# EAGLE design multi_board_support (EAGLE 6.5.0)

## Sheet 1 of 2
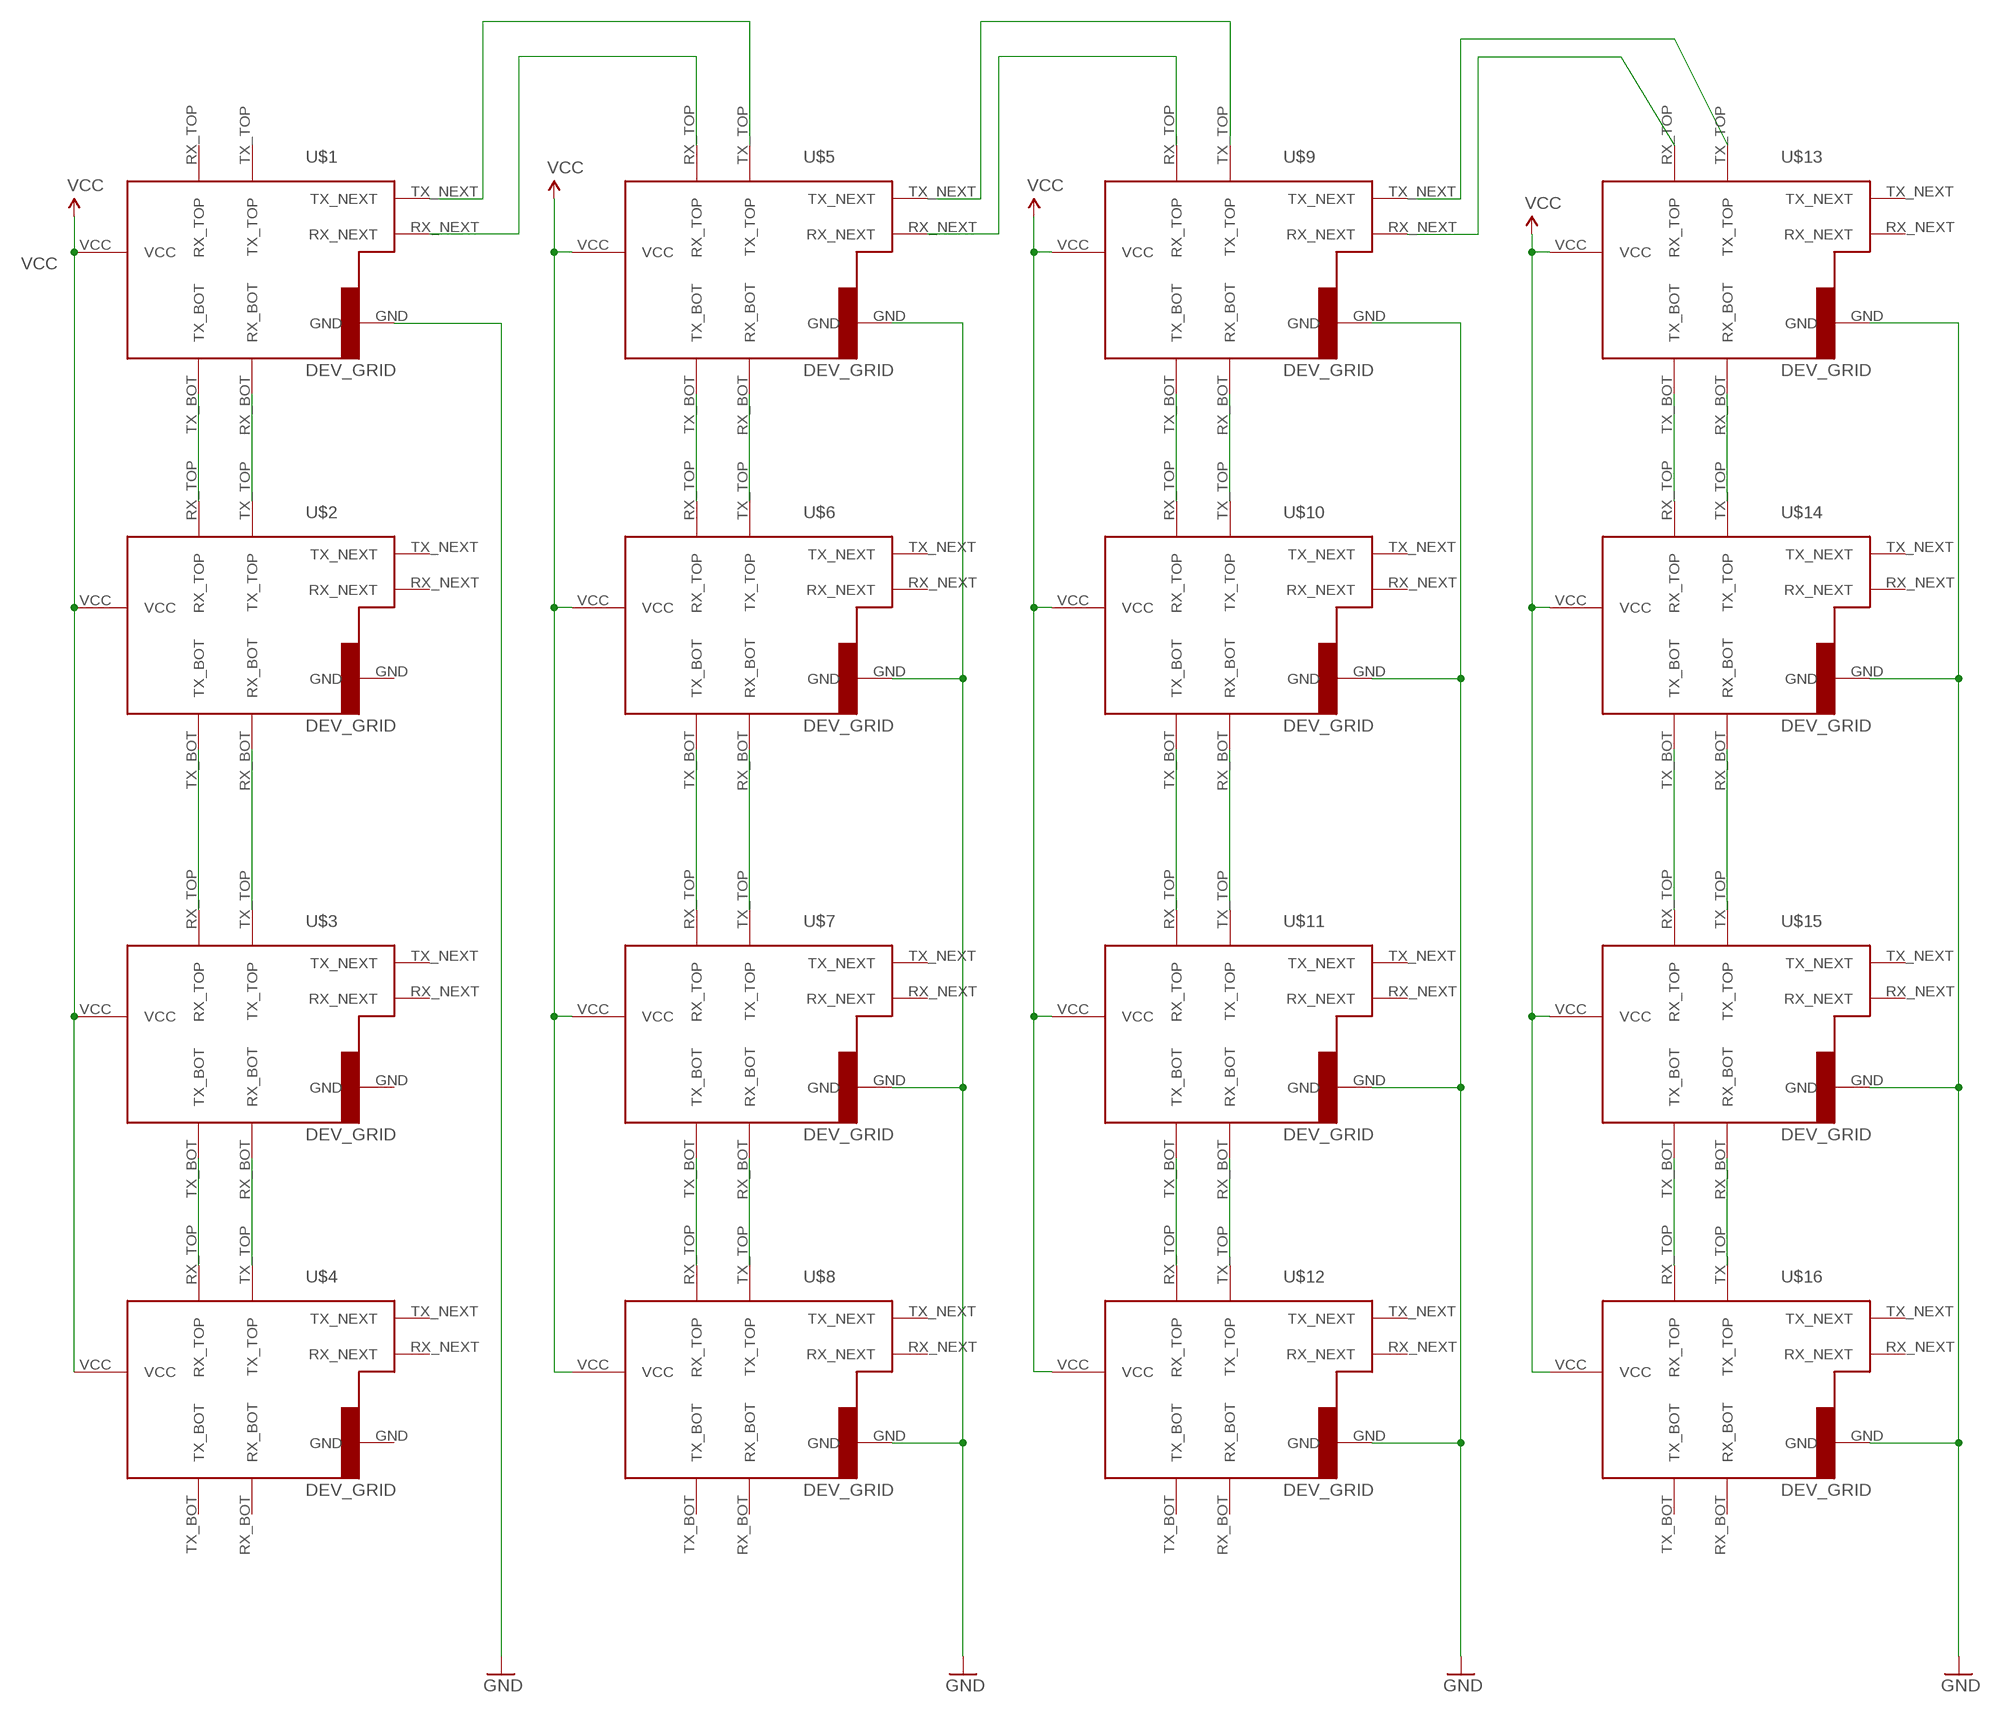
[diagram p0: schematic, sheet 1]

### Parts
U$1  DEV_GRID  [PCB_LAY]
U$2  DEV_GRID  [PCB_LAY]
U$3  DEV_GRID  [PCB_LAY]
U$4  DEV_GRID  [PCB_LAY]
U$5  DEV_GRID  [PCB_LAY]
U$6  DEV_GRID  [PCB_LAY]
U$7  DEV_GRID  [PCB_LAY]
U$8  DEV_GRID  [PCB_LAY]
U$9  DEV_GRID  [PCB_LAY]
U$10  DEV_GRID  [PCB_LAY]
U$11  DEV_GRID  [PCB_LAY]
U$12  DEV_GRID  [PCB_LAY]
U$13  DEV_GRID  [PCB_LAY]
U$14  DEV_GRID  [PCB_LAY]
U$15  DEV_GRID  [PCB_LAY]
U$16  DEV_GRID  [PCB_LAY]

### Nets
GND: U$1.GND U$5.GND U$6.GND U$7.GND U$8.GND U$9.GND U$10.GND U$11.GND U$12.GND U$13.GND U$14.GND U$15.GND U$16.GND
N$1: U$1.TX_BOT U$2.RX_TOP
N$2: U$1.RX_BOT U$2.TX_TOP
N$3: U$2.TX_BOT U$3.RX_TOP
N$4: U$2.RX_BOT U$3.TX_TOP
N$5: U$3.TX_BOT U$4.RX_TOP
N$6: U$3.RX_BOT U$4.TX_TOP
N$7: U$5.TX_BOT U$6.RX_TOP
N$8: U$5.RX_BOT U$6.TX_TOP
N$9: U$6.TX_BOT U$7.RX_TOP
N$10: U$6.RX_BOT U$7.TX_TOP
N$11: U$7.TX_BOT U$8.RX_TOP
N$12: U$7.RX_BOT U$8.TX_TOP
N$13: U$9.TX_BOT U$10.RX_TOP
N$14: U$9.RX_BOT U$10.TX_TOP
N$15: U$10.TX_BOT U$11.RX_TOP
N$16: U$10.RX_BOT U$11.TX_TOP
N$17: U$11.TX_BOT U$12.RX_TOP
N$18: U$11.RX_BOT U$12.TX_TOP
N$19: U$13.TX_BOT U$14.RX_TOP
N$20: U$13.RX_BOT U$14.TX_TOP
N$21: U$14.TX_BOT U$15.RX_TOP
N$22: U$14.RX_BOT U$15.TX_TOP
N$23: U$15.TX_BOT U$16.RX_TOP
N$24: U$15.RX_BOT U$16.TX_TOP
N$25: U$1.TX_NEXT U$5.TX_TOP
N$26: U$1.RX_NEXT U$5.RX_TOP
N$27: U$5.TX_NEXT U$9.TX_TOP
N$28: U$5.RX_NEXT U$9.RX_TOP
N$29: U$9.TX_NEXT U$13.TX_TOP
N$30: U$9.RX_NEXT U$13.RX_TOP
VCC: U$1.VCC U$2.VCC U$3.VCC U$4.VCC U$5.VCC U$6.VCC U$7.VCC U$8.VCC U$9.VCC U$10.VCC U$11.VCC U$12.VCC U$13.VCC U$14.VCC U$15.VCC U$16.VCC
Unconnected: U$1.RX_TOP U$1.TX_TOP U$2.RX_NEXT U$2.TX_NEXT U$3.RX_NEXT U$3.TX_NEXT U$4.RX_BOT U$4.RX_NEXT U$4.TX_BOT U$4.TX_NEXT U$6.RX_NEXT U$6.TX_NEXT U$7.RX_NEXT U$7.TX_NEXT U$8.RX_BOT U$8.RX_NEXT U$8.TX_BOT U$8.TX_NEXT U$10.RX_NEXT U$10.TX_NEXT U$11.RX_NEXT U$11.TX_NEXT U$12.RX_BOT U$12.RX_NEXT U$12.TX_BOT U$12.TX_NEXT U$13.RX_NEXT U$13.TX_NEXT U$14.RX_NEXT U$14.TX_NEXT U$15.RX_NEXT U$15.TX_NEXT U$16.RX_BOT U$16.RX_NEXT U$16.TX_BOT U$16.TX_NEXT

## Sheet 2 of 2

## Power pins joined to a net without a drawn wire
GND: U$2.GND U$3.GND U$4.GND

## Library data of the parts
U$1-U$16 = grid_component:DEV_GRID

## Board
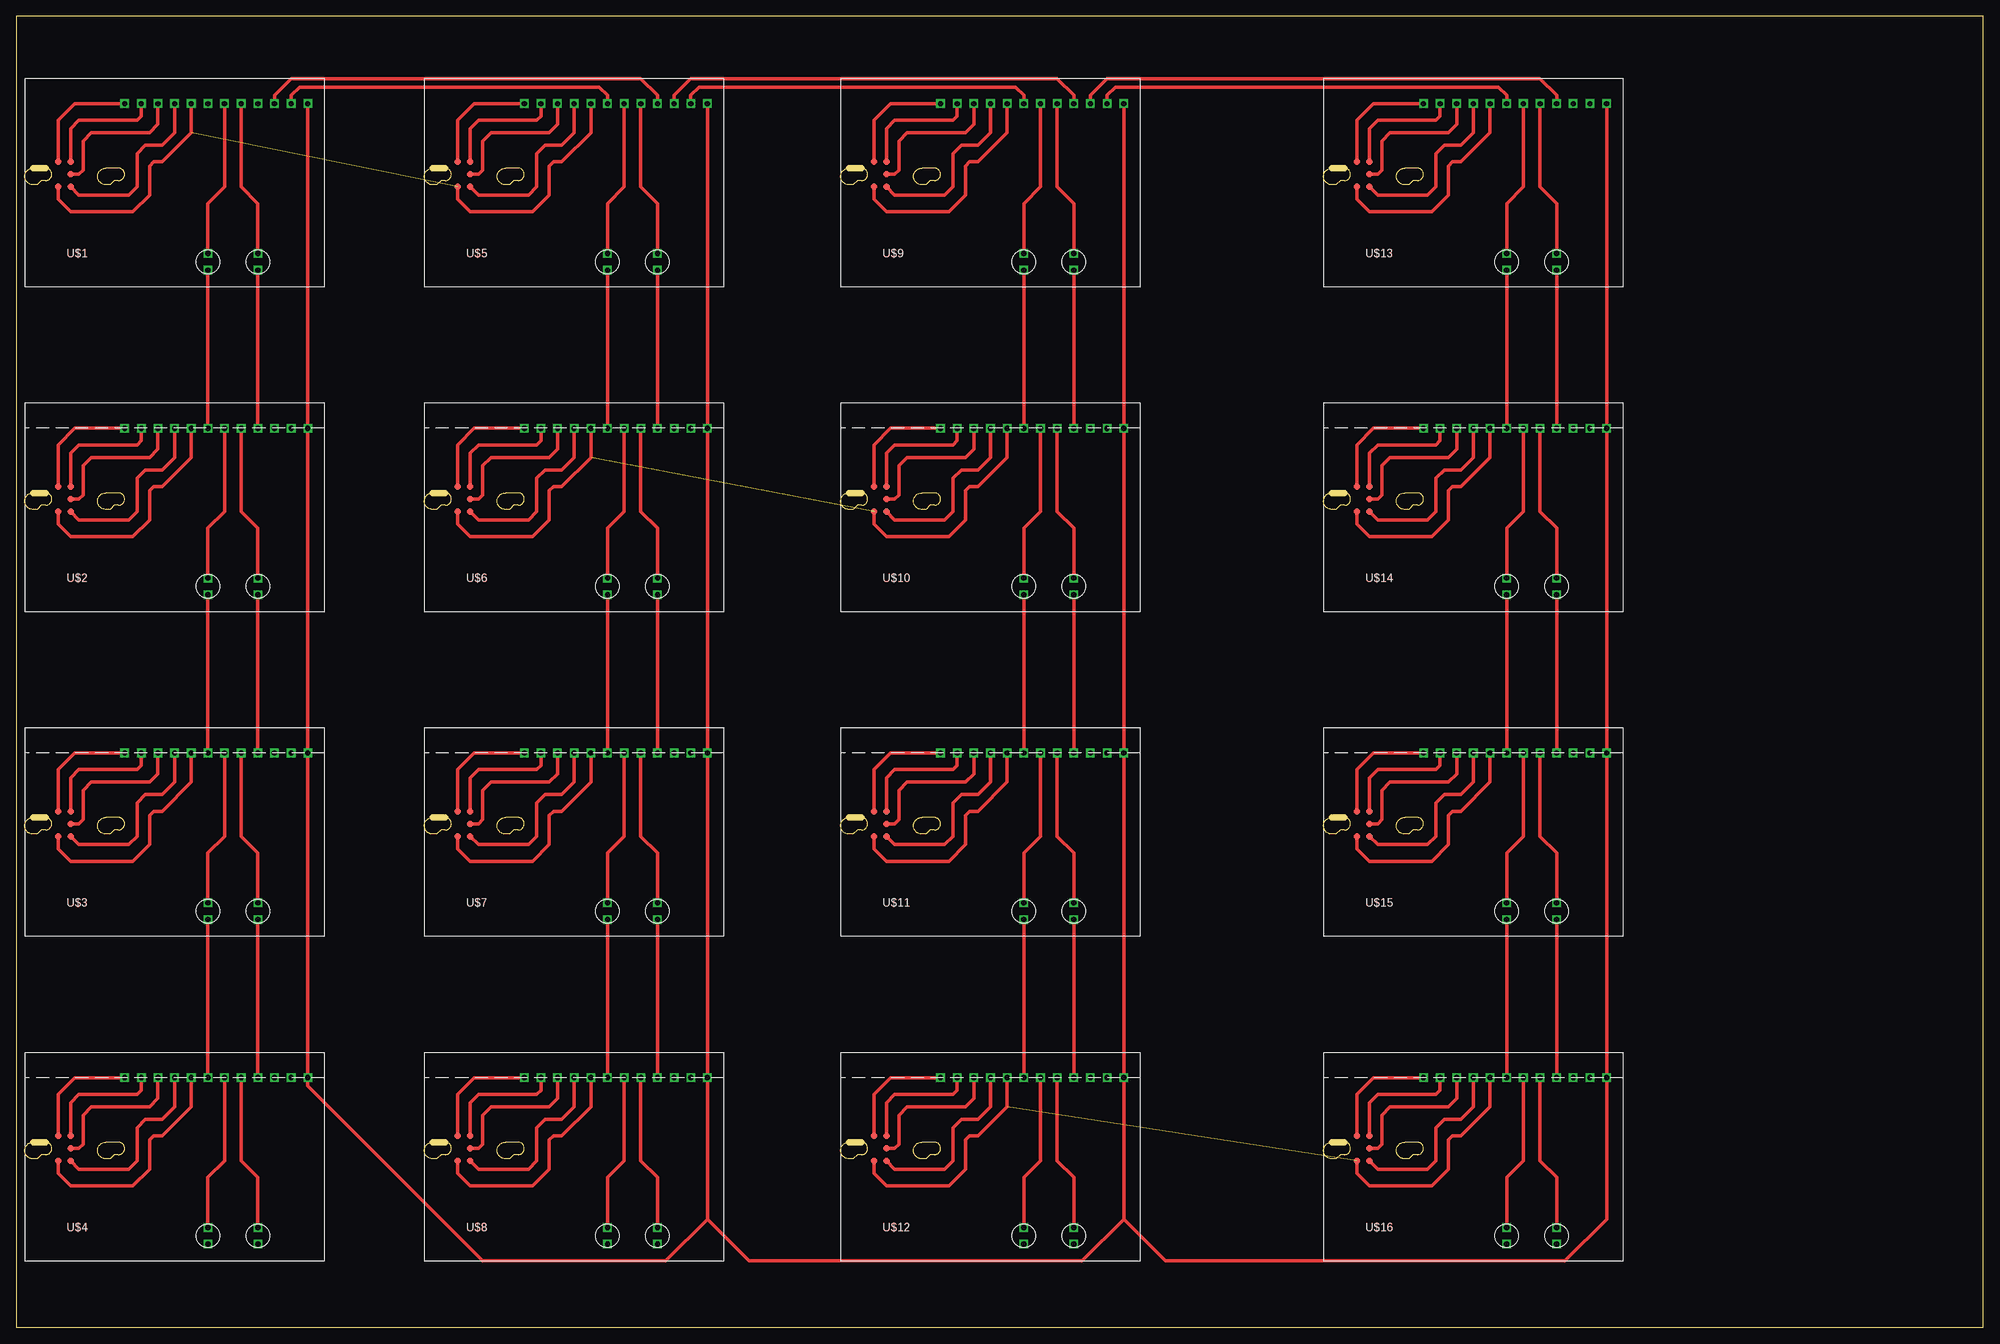
[diagram p1: board, top side]

Size 300 x 200 mm. Coordinates in mm from the lower left corner, seen from the top.
Outline: 0,0 300,0 300,200 0,200 0,0
Copper layers (1*16): Top 0.035mm / dielectric 1.5mm / Bottom 0.035mm
Design rules "default *": minimum track width 0.5mm, minimum drill 0.5mm, track to track 1mm, track to pad 1mm, pad to pad 1mm, via to via 1mm, smd to smd 1mm, copper to edge 40mil, drill to drill 8mil, minimum pad ring 10mil, minimum via ring 8mil, stop-mask expansion 4mil, vias tented up to drill 0mil, thermal gap 10mil

### Footprints (pad centres in the part's own frame; a part is rotated, then mirrored left to right if it is on the bottom)
PCB_LAY = drill 0.8 square: GND 0,0; P$9 2.54,-22.86; P$11 10.16,-22.86; PB1/MOSI/RX -7.62,0; PB2/MISO/TX -10.16,0; RESET -2.54,0; RX_BOT 10.16,-25.4; RX_BOT1 7.62,0; RX_NEXT 15.24,0; RX_TOP 2.54,0; SCK -5.08,0; TX_BOT 2.54,-25.4; TX_BOT1 5.08,0; TX_NEXT 12.7,0; TX_TOP 10.16,0; VCC 17.78,0 | smd 1 x 1: P$1 -20.32,-8.89; P$2 -18.415,-10.795; P$3 -18.415,-8.89; P$4 -20.32,-12.7; P$6 -18.415,-12.7

### Placement (x,y rotation side)
U$1  26.67,186.69 0 top
U$2  26.67,137.16 0 top
U$3  26.67,87.63 0 top
U$4  26.67,38.1 0 top
U$5  87.63,186.69 0 top
U$6  87.63,137.16 0 top
U$7  87.63,87.63 0 top
U$8  87.63,38.1 0 top
U$9  151.13,186.69 0 top
U$10  151.13,137.16 0 top
U$11  151.13,87.63 0 top
U$12  151.13,38.1 0 top
U$13  224.79,186.69 0 top
U$14  224.79,137.16 0 top
U$15  224.79,87.63 0 top
U$16  224.79,38.1 0 top

### Tracks (layer width: path | path; a pad name or v marks a point on that pad's centre or on a via)
GND  (3 unrouted)
  pour Top: 0,200.66 299.72,200.66 299.72,0 0,0
N$1
  Top 0.5: U$1.TX_BOT U$2.RX_TOP
N$2
  Top 0.5: U$1.RX_BOT U$2.TX_TOP
N$3
  Top 0.5: U$2.TX_BOT U$3.RX_TOP
N$4
  Top 0.5: U$2.RX_BOT U$3.TX_TOP
N$5
  Top 0.5: U$3.TX_BOT U$4.RX_TOP
N$6
  Top 0.5: U$3.RX_BOT U$4.TX_TOP
N$7
  Top 0.5: U$5.TX_BOT U$6.RX_TOP
N$8
  Top 0.5: U$5.RX_BOT U$6.TX_TOP
N$9
  Top 0.5: U$6.TX_BOT U$7.RX_TOP
N$10
  Top 0.5: U$6.RX_BOT U$7.TX_TOP
N$11
  Top 0.5: U$7.TX_BOT U$8.RX_TOP
N$12
  Top 0.5: U$7.RX_BOT U$8.TX_TOP
N$13
  Top 0.5: U$9.TX_BOT U$10.RX_TOP
N$14
  Top 0.5: U$9.RX_BOT U$10.TX_TOP
N$15
  Top 0.5: U$10.TX_BOT U$11.RX_TOP
N$16
  Top 0.5: U$10.RX_BOT U$11.TX_TOP
N$17
  Top 0.5: U$11.TX_BOT U$12.RX_TOP
N$18
  Top 0.5: U$11.RX_BOT U$12.TX_TOP
N$19
  Top 0.5: U$13.TX_BOT U$14.RX_TOP
N$20
  Top 0.5: U$13.RX_BOT U$14.TX_TOP
N$21
  Top 0.5: U$14.TX_BOT U$15.RX_TOP
N$22
  Top 0.5: U$14.RX_BOT U$15.TX_TOP
N$23
  Top 0.5: U$15.TX_BOT U$16.RX_TOP
N$24
  Top 0.5: U$15.RX_BOT U$16.TX_TOP
N$25
  Top 0.5: U$1.TX_NEXT 39.37,187.96 41.91,190.5 95.25,190.5 97.79,187.96 U$5.TX_TOP
N$26
  Top 0.5: U$1.RX_NEXT 41.91,187.96 43.18,189.23 88.9,189.23 90.17,187.96 U$5.RX_TOP
N$27
  Top 0.5: U$5.TX_NEXT 100.33,187.96 102.87,190.5 158.75,190.5 161.29,187.96 U$9.TX_TOP
N$28
  Top 0.5: U$5.RX_NEXT 102.87,187.96 104.14,189.23 152.4,189.23 153.67,187.96 U$9.RX_TOP
N$29
  Top 0.5: U$9.TX_NEXT 163.83,187.96 166.37,190.5 232.41,190.5 234.95,187.96 U$13.TX_TOP
N$30
  Top 0.5: U$9.RX_NEXT 166.37,187.96 167.64,189.23 226.06,189.23 227.33,187.96 U$13.RX_TOP
VCC
  Top 0.5: U$13.VCC U$14.VCC U$15.VCC U$16.VCC 242.57,16.51 236.22,10.16 175.26,10.16 168.91,16.51 | U$9.VCC U$10.VCC U$11.VCC U$12.VCC 168.91,16.51 | U$1.VCC U$2.VCC U$3.VCC U$4.VCC 44.45,36.83 71.12,10.16 99.06,10.16 105.41,16.51 | U$5.VCC U$6.VCC U$7.VCC U$8.VCC 105.41,16.51 | 168.91,16.51 162.56,10.16 111.76,10.16 105.41,16.51